# EAGLE design LED Controller Board (EAGLE 8.5.2)
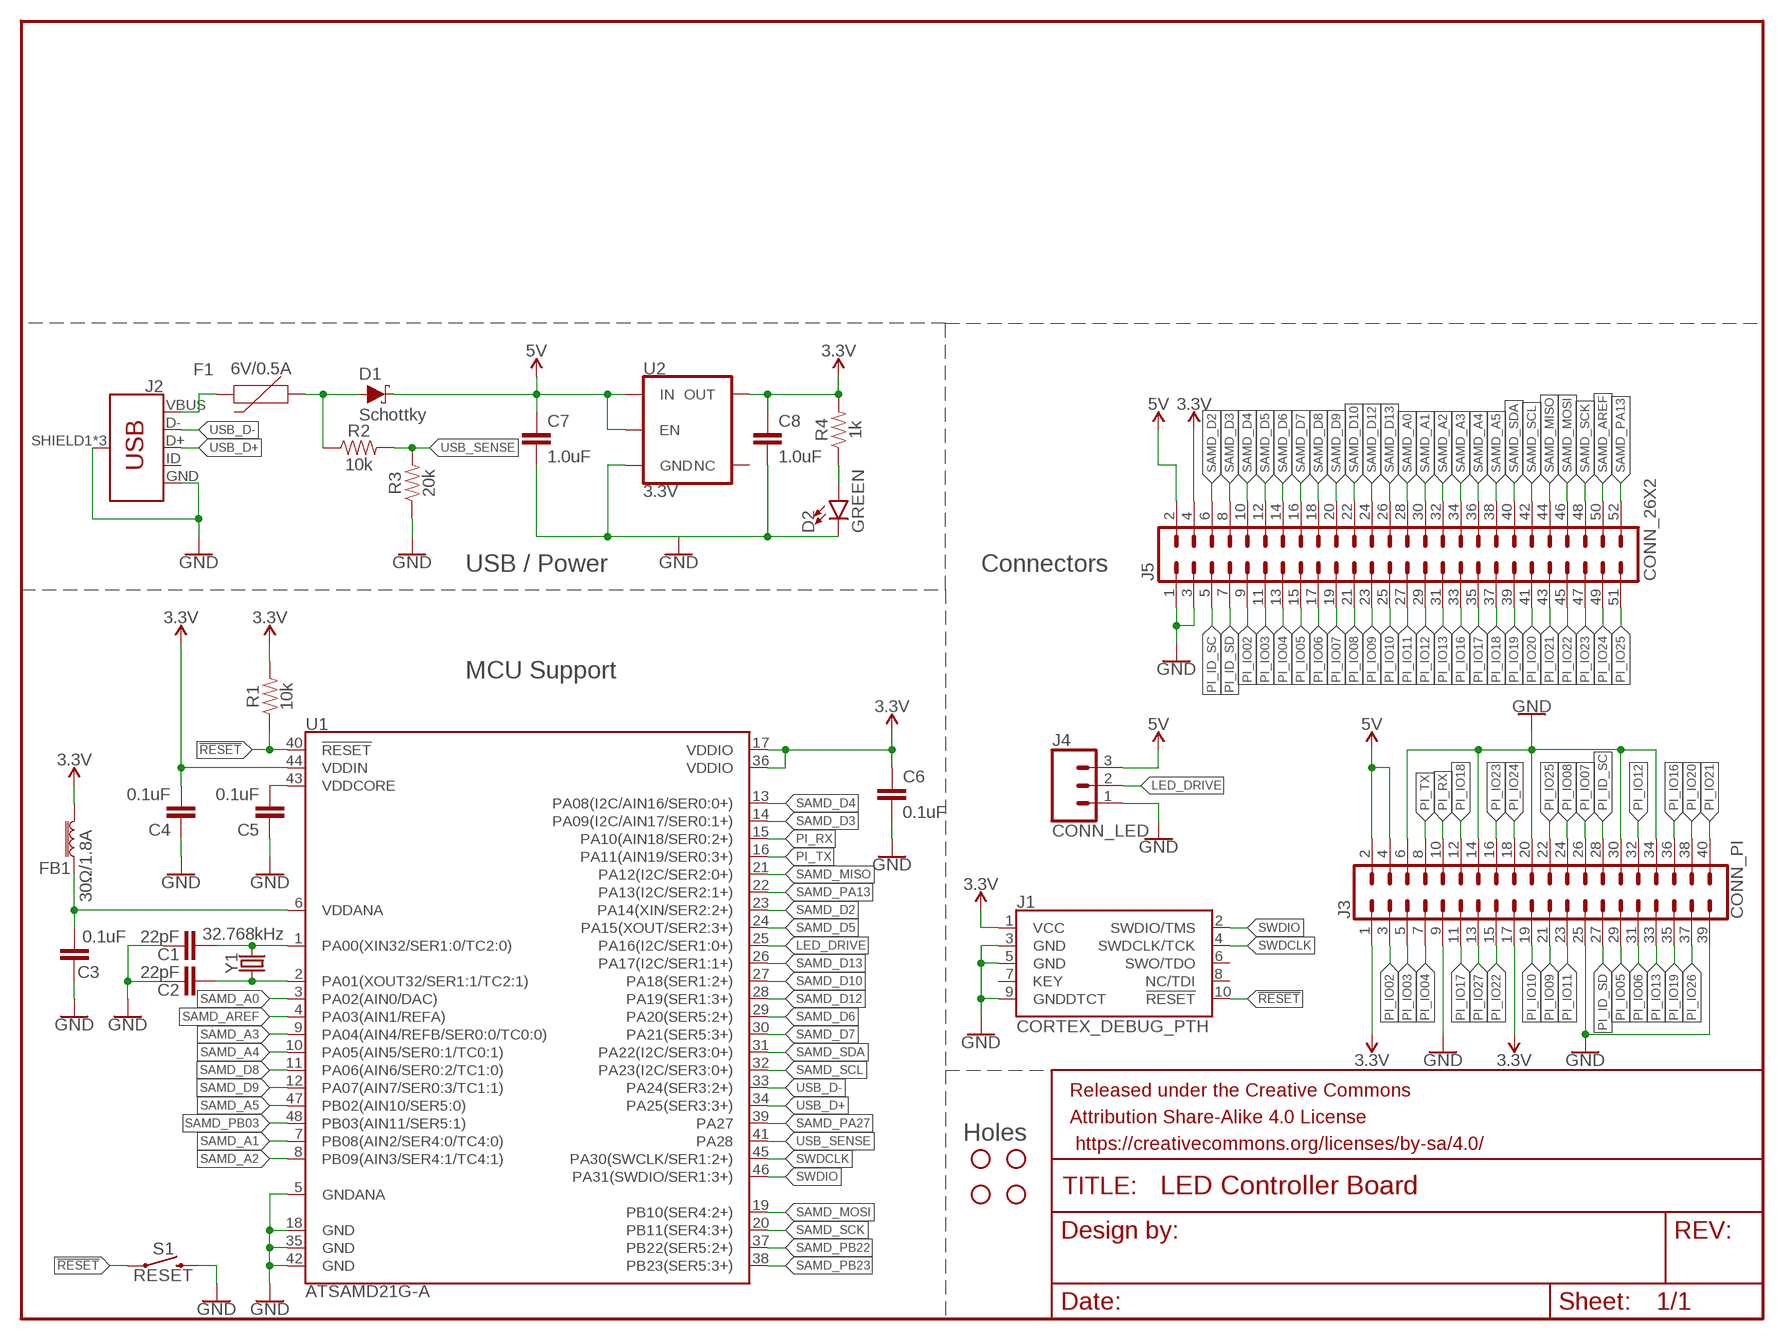
[diagram p0: schematic, sheet 1]

## Parts
C1  22pF  22PF-0603-50V-5%  [0603]
C2  22pF  22PF-0603-50V-5%  [0603]
C3  0.1uF  0.1UF-0603-25V-5%  [0603]
C4  0.1uF  0.1UF-0603-25V-5%  [0603]
C5  0.1uF  0.1UF-0603-25V-5%  [0603]
C6  0.1uF  0.1UF-0603-25V-5%  [0603]
C7  1.0uF  1.0UF-0603-16V-10%  [0603]
C8  1.0uF  1.0UF-0603-16V-10%  [0603]
D1  Schottky  DIODE-SCHOTTKY-BAT20J  [SOD-323]
D2  GREEN  LED-GREEN0603  [LED-0603]
F1  6V/0.5A  PPTC_HALF-AMP  [1206]
FB1  30Ω/1.8A  FERRITE_BEAD-0603  [0603]
FRAME1  FRAME-LETTERNO_PACKAGE  [DUMMY]
H1  STAND-OFFTIGHT  [STAND-OFF-TIGHT]
H2  STAND-OFFTIGHT  [STAND-OFF-TIGHT]
H3  STAND-OFFTIGHT  [STAND-OFF-TIGHT]
H4  STAND-OFFTIGHT  [STAND-OFF-TIGHT]
J1  CORTEX_DEBUG_PTH  [2X5-PTH-1.27MM]
J2  USB_MICRO-B_FEMALE-SMT  [USB-B-MICRO-SMD]
J3  CONN_PI  CONN_20X2  [2X20]
J4  CONN_LED  CONN_03LOCK  [1X03_LOCK]
J5  CONN_26X2  [2X26]
R1  10k  10KOHM-0603-1/10W-1%  [0603]
R2  10k  10KOHM-0603-1/10W-1%  [0603]
R3  20k  20KOHM-0603-1/10W-1%  [0603]
R4  1k  1KOHM-0603-1/10W-1%  [0603]
S1  RESET  MOMENTARY-SWITCH-SPST-PTH-RIGHT-ANGLE-KIT  [TACTILE_SWITCH_PTH_RIGHT_ANGLE_KIT]
U1  ATSAMD21G-A  [TQFP-48]
U2  3.3V  V_REG_AP2112K-3.3V  [SOT23-5]
Y1  32.768kHz  CRYSTAL-32.768KHZSMD-3.2X1.5  [CRYSTAL-SMD-3.2X1.5MM]

## Nets
3.3V: C4.2 C6.1 C8.1 FB1.2 J1.1(VCC) J3.1 J3.17 J5.4 R1.2 R4.2 U1.17(VDDIO) U1.36(VDDIO) U1.44(VDDIN) U2.5(OUT)
5V: C7.1 D1.C J3.2 J3.4 J4.3 J5.2 U2.1(IN) U2.3(EN)
!RESET: J1.10(!RESET) R1.1 S1.1 U1.40(!RESET!)
GND: C1.1 C2.1 C3.1 C4.1 C5.1 C6.2 C7.2 C8.2 D2.C J1.3(GND) J1.5(GND) J1.9(GNDDTCT) J2.GND J2.SHIELD1(SHIELD) J2.SHIELD2(SHIELD) J2.SHIELD3(SHIELD) J3.6 J3.9 J3.14 J3.20 J3.25 J3.30 J3.34 J3.39 J4.1 J5.1 J5.3 R3.1 S1.2 U1.5(GNDANA) U1.18(GND) U1.35(GND) U1.42(GND) U2.2(GND)
LED_DRIVE: J4.2 U1.25(PA16(I2C/SER1:0+))
N$1: C1.2 U1.1(PA00(XIN32/SER1:0/TC2:0)) Y1.P$2
N$2: C2.2 U1.2(PA01(XOUT32/SER1:1/TC2:1)) Y1.P$1
N$3: C3.2 FB1.1 U1.6(VDDANA)
N$4: C5.2 U1.43(VDDCORE)
N$25: F1.2 J2.VBUS
N$26: D1.A F1.1 R2.1
N$44: D2.A R4.1
PI_ID_SC: J3.28 J5.5
PI_ID_SD: J3.27 J5.7
PI_IO02: J3.3 J5.9
PI_IO03: J3.5 J5.11
PI_IO04: J3.7 J5.13
PI_IO05: J3.29 J5.15
PI_IO06: J3.31 J5.17
PI_IO07: J3.26 J5.19
PI_IO08: J3.24 J5.21
PI_IO09: J3.21 J5.23
PI_IO10: J3.19 J5.25
PI_IO11: J3.23 J5.27
PI_IO12: J3.32 J5.29
PI_IO13: J3.33 J5.31
PI_IO16: J3.36 J5.33
PI_IO17: J3.11 J5.35
PI_IO18: J3.12 J5.37
PI_IO19: J3.35 J5.39
PI_IO20: J3.38 J5.41
PI_IO21: J3.40 J5.43
PI_IO22: J3.15 J5.45
PI_IO23: J3.16 J5.47
PI_IO24: J3.18 J5.49
PI_IO25: J3.22 J5.51
PI_IO26: J3.37
PI_IO27: J3.13
PI_RX: J3.10 U1.15(PA10(AIN18/SER0:2+))
PI_TX: J3.8 U1.16(PA11(AIN19/SER0:3+))
SAMD_A0: J5.28 U1.3(PA02(AIN0/DAC))
SAMD_A1: J5.30 U1.7(PB08(AIN2/SER4:0/TC4:0))
SAMD_A2: J5.32 U1.8(PB09(AIN3/SER4:1/TC4:1))
SAMD_A3: J5.34 U1.9(PA04(AIN4/REFB/SER0:0/TC0:0))
SAMD_A4: J5.36 U1.10(PA05(AIN5/SER0:1/TC0:1))
SAMD_A5: J5.38 U1.47(PB02(AIN10/SER5:0))
SAMD_AREF: J5.50 U1.4(PA03(AIN1/REFA))
SAMD_D2: J5.6 U1.23(PA14(XIN/SER2:2+))
SAMD_D3: J5.8 U1.14(PA09(I2C/AIN17/SER0:1+))
SAMD_D4: J5.10 U1.13(PA08(I2C/AIN16/SER0:0+))
SAMD_D5: J5.12 U1.24(PA15(XOUT/SER2:3+))
SAMD_D6: J5.14 U1.29(PA20(SER5:2+))
SAMD_D7: J5.16 U1.30(PA21(SER5:3+))
SAMD_D8: J5.18 U1.11(PA06(AIN6/SER0:2/TC1:0))
SAMD_D9: J5.20 U1.12(PA07(AIN7/SER0:3/TC1:1))
SAMD_D10: J5.22 U1.27(PA18(SER1:2+))
SAMD_D12: J5.24 U1.28(PA19(SER1:3+))
SAMD_D13: J5.26 U1.26(PA17(I2C/SER1:1+))
SAMD_MISO: J5.44 U1.21(PA12(I2C/SER2:0+))
SAMD_MOSI: J5.46 U1.19(PB10(SER4:2+))
SAMD_PA13: J5.52 U1.22(PA13(I2C/SER2:1+))
SAMD_PA27: U1.39(PA27)
SAMD_PB03: U1.48(PB03(AIN11/SER5:1))
SAMD_PB22: U1.37(PB22(SER5:2+))
SAMD_PB23: U1.38(PB23(SER5:3+))
SAMD_SCK: J5.48 U1.20(PB11(SER4:3+))
SAMD_SCL: J5.42 U1.32(PA23(I2C/SER3:0+))
SAMD_SDA: J5.40 U1.31(PA22(I2C/SER3:0+))
SWDCLK: J1.4(SWDCLK/TCK) U1.45(PA30(SWCLK/SER1:2+))
SWDIO: J1.2(SWDIO/TMS) U1.46(PA31(SWDIO/SER1:3+))
USB_D+: J2.D+ U1.34(PA25(SER3:3+))
USB_D-: J2.D- U1.33(PA24(SER3:2+))
USB_SENSE: R2.2 R3.2 U1.41(PA28)
Unconnected: J1.6(SWO/TDO) J1.7(KEY) J1.8(NC/TDI) J2.ID U2.4(NC)

## Notes on the sheet
- USB / Power | Connectors
- MCU Support
- Holes

## Library data of the parts
C1 C2 = SparkFun-Capacitors:22PF: 22pF ceramic capacitors A capacitor is a passive two-terminal electrical component used to store electrical energy temporarily in an electric field.; PROD_ID: CAP-07876
C3-C6 = SparkFun-Capacitors:0.1UF: 0.1µF ceramic capacitors A capacitor is a passive two-terminal electrical component used to store electrical energy temporarily in an electric field.; PROD_ID: CAP-08604
C7 C8 = SparkFun-Capacitors:1.0UF: 1µF ceramic capacitors A capacitor is a passive two-terminal electrical component used to store electrical energy temporarily in an electric field.; PROD_ID: CAP-00868
D1 = SparkFun-DiscreteSemi:DIODE-SCHOTTKY: Schottky diode A Schottky diode is a semiconductor diode which has a low forward voltage drop and a very fast switching action.; PROD_ID: DIO-11623; VALUE: 1A/23V/620mV
D2 = SparkFun-LED:LED-GREEN: Green SMD LED Used in manufacturing of various products at SparkFun Packages: 0603 - SMD 0603 package [Product Link] <http://www.futureelectronics.com/en/technologies/semiconductors/optoelectronics/leds/Pages/9894312-LTST-C190GKT.aspx?CrossPart=HSMG-C190&IM=0> LilyPad 1206 - SMD1206 LilyPad package [Product Link] <http://www.futureelectronics.com/en/Technologies/Product.aspx?ProductID=IN150NGHARVATEKCORPORATION2049943&IM=0> 1206 - SMD1206 package [Product Link] <http://www.futureelectronics.com/en/technologies/semiconductors/optoelectronics/leds/Pages/8315665-LTST-C150KGKT.aspx?IM=0> 1206 Bottom Mount -SMD 1206 Bottom Mount [Product Link] <http://www.digikey.com/product-detail/en/lite-on-inc/LTST-C230KGKT/160-1456-1-ND/386854> SparkFun Products: Pro Mini 328 -5V <https://www.sparkfun.com/products/821> RedBoard <https://www.sparkfun.com/products/12757> MP3 Trigger <https://www.sparkfun.com/products/13720> Makey Makey <https://www.sparkfun.com/products/11076>; PROD_ID: DIO-00821
F1 = SparkFun-Fuses:PPTC: Resettable Fuse PPTC Resettable Fuse. Really a sort of resistor with a polymeric positive temperature coefficient whose resistance increases dramatically with an increase in temperature. When heated by the power passing through the resistance rises causing the current to be limited, protecting the circuit. This is achieved by the transition of the polymer from a crystalline to an amorphous state where the conductive carbon separates breaking the conductive pathways found in the cool crystalline structure. When a PPTC cools back down it resumes conducting letting the circuit turn back on. SparkFun Products: SparkFun RedBoard - Programmed with Arduino <https://www.sparkfun.com/products/12757> Pro Micro - 5V/16MHz <https://www.sparkfun.com/products/12640> Arduino Pro 328 - 5V/16MHz <https://www.sparkfun.com/products/10915> MP3 Trigger <https://www.sparkfun.com/products/13720>; PROD_ID: RES-08585
FB1 = SparkFun-Coils:FERRITE_BEAD: Ferrite Bead (blocks, cores, rings, chokes, etc.) Inductor with layers of ferrite used to suppress high frequencies. Often used to isolate high frequency noise. SparkFun Products: IOIO-OTG - V2.2 <https://www.sparkfun.com/products/13613> SparkFun SAMD21 Mini Breakout <https://www.sparkfun.com/products/13664> SparkFun 6 Degrees of Freedom Breakout - LSM6DS3 <https://www.sparkfun.com/products/13339> SparkFun SAMD21 Dev Breakout <https://www.sparkfun.com/products/13672>; PROD_ID: NDUC-07859
FRAME1 = SparkFun-Aesthetics:FRAME-LETTER: Schematic Frame - Letter Standard 8.5x11 US Letter frame; DESIGNER: Nobody; VERSION: v01
H1-H4 = SparkFun-Hardware:STAND-OFF: Stand Off Drill holes for mechanically mounting via screws, standoffs, etc. Note: Use the keepout ring to avoid running the screw head into surrounding components. Variant Overviews STAND-OFF - Mechanical footprint for a #4 phillips button head screw. STAND-OFF-TIGHT - Mechanical footprint for a #4 phillips button head screw, Example SparkFun Products Screw - Phillips Head (1/4", 4-40, 10 pack) <https://www.sparkfun.com/products/10453> (PRT-10453) Screw - Phillips Head (1/2", 4-40, 10 pack) <https://www.sparkfun.com/products/10452> (PRT-10452) Screw - Phillips Head (3/4", 4-40, 10 pack) <https://www.sparkfun.com/products/10451> (PRT-10451) Screw - Phillips Head (1", 4-40, 10 pack) <https://www.sparkfun.com/products/10450> (PRT-10450)
J1 = SparkFun-Connectors:CORTEX_DEBUG: Cortex Debug Connector - 10 pin Supports JTAG debug, Serial Wire debug, and Serial Wire Viewer. PTH and SMD connector options available. General Connector Information <http://infocenter.arm.com/help/topic/com.arm.doc.faqs/attached/13634/cortex_debug_connectors.pdf> Products: PTH Connector <http://www.digikey.com/product-detail/en/cnc-tech/3220-10-0100-00/1175-1627-ND/3883661> -via Digi-Key SparkFun PSoc <https://www.sparkfun.com/products/13229> SparkFun T <https://www.sparkfun.com/products/13810>
J2 = SparkFun-Connectors:USB_MICRO-B: USB Type Micro-B Connector Male/female and PTH/SMT variants SparkFun Products: SparkFun microB USB Breakout <https://www.sparkfun.com/products/12035> SparkFun USB microB Plug Breakout <https://www.sparkfun.com/products/10031> SparkFun ESP8266 Thing <https://www.sparkfun.com/products/13231>; PROD_ID: CONN-11752
J3 = SparkFun-Connectors:CONN_20X2: Multi connection point. Often used as Generic Header-pin footprint for 0.1 inch spaced/style header connections On any of the 0.1 inch spaced packages, you can populate with these: Break Away Headers - Straight <https://www.sparkfun.com/products/116> (PRT-00116) Break Away Male Headers - Right Angle <https://www.sparkfun.com/products/553> (PRT-00553) Female Headers <https://www.sparkfun.com/products/115> (PRT-00115) Break Away Headers - Machine Pin <https://www.sparkfun.com/products/117> (PRT-00117) Break Away Female Headers - Swiss Machine Pin <https://www.sparkfun.com/products/743> (PRT-00743)
J4 = SparkFun-Connectors:CONN_03: Multi connection point. Often used as Generic Header-pin footprint for 0.1 inch spaced/style header connections On any of the 0.1 inch spaced packages, you can populate with these: Break Away Headers - Straight <https://www.sparkfun.com/products/116> (PRT-00116) Break Away Male Headers - Right Angle <https://www.sparkfun.com/products/553> (PRT-00553) Female Headers <https://www.sparkfun.com/products/115> (PRT-00115) Break Away Headers - Machine Pin <https://www.sparkfun.com/products/117> (PRT-00117) Break Away Female Headers - Swiss Machine Pin <https://www.sparkfun.com/products/743> (PRT-00743) Stackable Header - 3 Pin (Female, 0.1") <https://www.sparkfun.com/products/13875> (PRT-13875) For SCREWTERMINALS and SPRING TERMINALS visit here: Screw Terimnals on SparkFun.com <https://www.sparkfun.com/search/results?term=Screw+Terminals> (5mm/3.5mm/2.54mm spacing) This device is also useful as a general connection point to wire up your design to another part of your project. Our various solder wires solder well into these plated through hole pads. Hook-Up Wire - Assortment (Stranded, 22 AWG) <https://www.sparkfun.com/products/11375> (PRT-11375) Hook-Up Wire - Assortment (Solid Core, 22 AWG) <https://www.sparkfun.com/products/11367> (PRT-11367) View the entire wire category on our website here <https://www.sparkfun.com/categories/141> Special notes: Molex polarized connector foot print use with SKU : PRT-08232 with associated crimp pins and housings.
J5 = SparkFun-Connectors:CONN_26X2: Multi connection point. Often used as Generic Header-pin footprint for 0.1 inch spaced/style header connections On any of the 0.1 inch spaced packages, you can populate with these: Break Away Headers - Straight <https://www.sparkfun.com/products/116> (PRT-00116) Break Away Male Headers - Right Angle <https://www.sparkfun.com/products/553> (PRT-00553) Female Headers <https://www.sparkfun.com/products/115> (PRT-00115) Break Away Headers - Machine Pin <https://www.sparkfun.com/products/117> (PRT-00117) Break Away Female Headers - Swiss Machine Pin <https://www.sparkfun.com/products/743> (PRT-00743)
R1 R2 = SparkFun-Resistors:10KOHM: 10kΩ resistor A resistor is a passive two-terminal electrical component that implements electrical resistance as a circuit element. Resistors act to reduce current flow, and, at the same time, act to lower voltage levels within circuits. - Wikipedia; PROD_ID: RES-00824
R3 = SparkFun-Resistors:20KOHM: 20kΩ resistor A resistor is a passive two-terminal electrical component that implements electrical resistance as a circuit element. Resistors act to reduce current flow, and, at the same time, act to lower voltage levels within circuits. - Wikipedia; PROD_ID: RES-09383
R4 = SparkFun-Resistors:1KOHM: 1kΩ resistor A resistor is a passive two-terminal electrical component that implements electrical resistance as a circuit element. Resistors act to reduce current flow, and, at the same time, act to lower voltage levels within circuits. - Wikipedia; PROD_ID: RES-07856
S1 = SparkFun-Switches:MOMENTARY-SWITCH-SPST: Momentary Switch (Pushbutton) - SPST Normally-open (NO) SPST momentary switches (buttons, pushbuttons). Variants PTH-12MM - 12mm square, through-hole Momentary Pushbutton Switch - 12mm Square <https://www.sparkfun.com/products/9190> (COM-09190) PTH-6.0MM, PTH-6.0MM-KIT - 6.0mm square, through-hole Mini Pushbutton Switch <https://www.sparkfun.com/products/97> (COM-00097) KIT package intended for soldering kit's - only one side of pads' copper is exposed. PTH-RIGHT-ANGLE-KIT - Right-angle, through-hole Right Angle Tactile Button <https://www.sparkfun.com/products/10791> - Used on SparkFun BigTime Watch Kit <https://www.sparkfun.com/products/11734> SMD-12MM - 12mm square, surface-mount Tactile Button - SMD (12mm) <https://www.sparkfun.com/products/12993> (COM-12993) Used on SparkFun PicoBoard <https://www.sparkfun.com/products/11888> SMD-4.5MM - 4.5mm Square Trackball Switch Used on SparkFun Blackberry Trackballer Breakout <https://www.sparkfun.com/products/13169> SMD-4.6MMX2.8MM - 4.60mm x 2.80mm, surface mount Used on SparkFun SAMD21 Mini Breakout <https://www.sparkfun.com/products/13664> SMD-5.2MM, SMD-5.2-REDUNDANT - 5.2mm square, surface-mount Mini Pushbutton Switch - SMD <https://www.sparkfun.com/products/8720> (COM-08720) Used on Arduino Pro Mini <https://www.sparkfun.com/products/11114> REDUNDANT package connects both switch circuits together SMD-6.0X3.5MM - 6.0 x 3.5mm, surface mount Momentary Reset Switch SMD <https://www.sparkfun.com/products/8229> (COM-08229) SMD-6.2MM-TALL - 6.2mm square, surface mount Tactile Button - SMD (6mm) <https://www.sparkfun.com/products/12992> Used on SparkFun Digital Sandbox <https://www.sparkfun.com/products/12651> SMD-RIGHT-ANGLE - Right-angle, surface mount Used on SparkFun Block for Intel® Edison - Arduino <https://www.sparkfun.com/products/13036>; PROD_ID: CONN-10672; SF_SKU: COM-10791
U1 = SparkFun-IC-Microcontroller:ATSAMD21G: Atmel SAMD21G SMART ARM-Based Microcontroller The Atmel ® | SMART ™ SAM D21 is a series of low-power microcontrollers using the 32-bit ARM ® Cortex ® -M0+ processor, and ranging from 32- to 64-pins with up to 256KB Flash and 32KB of SRAM. The SAM D21 devices operate at a maximum frequency of 48MHz and reach 2.46 CoreMark/MHz. They are designed for simple and intuitive migration with identical peripheral modules, hex compatible code, identical linear address map and pin compatible migration paths between all devices in the product series. All devices include intelligent and flexible peripherals, Atmel Event System for inter-peripheral signaling, and support for capacitive touch button, slider and wheel user interfaces. Datasheet <https://cdn.sparkfun.com/datasheets/Dev/Arduino/Boards/Atmel-42181-SAM-D21_Datasheet.pdf> SparkFun Products SparkFun SAMD21 Mini Breakout <https://www.sparkfun.com/products/13664> (DEV-13664) SparkFun SAMD21 Dev Breakout <https://www.sparkfun.com/products/13672> (DEV-13672); PROD_ID: IC-13064
U2 = SparkFun-IC-Power:V_REG_AP2112: AP2112 - 600mA CMOS LDO Regulator w/ Enable The AP2112 is CMOS process low dropout linear regulator with enable function, the regulator delivers a guaranteed 600mA (min.) continuous load current. Features Output Voltage Accuracy: ±1.5% Output Current: 600mA (Min.) Foldback Short Current Protection: 50mA Enable Function to Turn ON/OFF VOUT Low Dropout Voltage (3.3V): 250mV (Typ.) @IOUT=600mA Excellent Load Regulation: 0.2%/A (Typ.) Excellent Line Regulation: 0.02%/V (Typ.) Low Quiescent Current: 55μA (Typ.) Low Standby Current: 0.01μA (Typ.) Low Output Noise: 50μVRMS PSRR: 100Hz -65dB, 1kHz -65dB OTSD Protection Stable with 1.0μF Flexible Cap: Ceramic, Tantalum and Aluminum Electrolytic Operation Temperature Range: -40°C to 85°C ESD: MM 400V, HBM 4000V; PROD_ID: VREG-12457
Y1 = SparkFun-Clocks:CRYSTAL-32.768KHZ: 32.768kHz Crystal Frequency: 32.768kHz Frequency Stability: ±20ppm Load Capacitance: 12.5pF (PTH-2X6 & SMD-3.2X1.5), 6pF (SMD-2X6) SparkFun Products: SparkFun BigTime Watch Kit <https://www.sparkfun.com/products/11734> SparkFun nRF52832 Breakout <https://www.sparkfun.com/products/13990> SparkFun Real Time Clock Module <https://www.sparkfun.com/products/12708>; PROD_ID: XTAL-13062

## Board
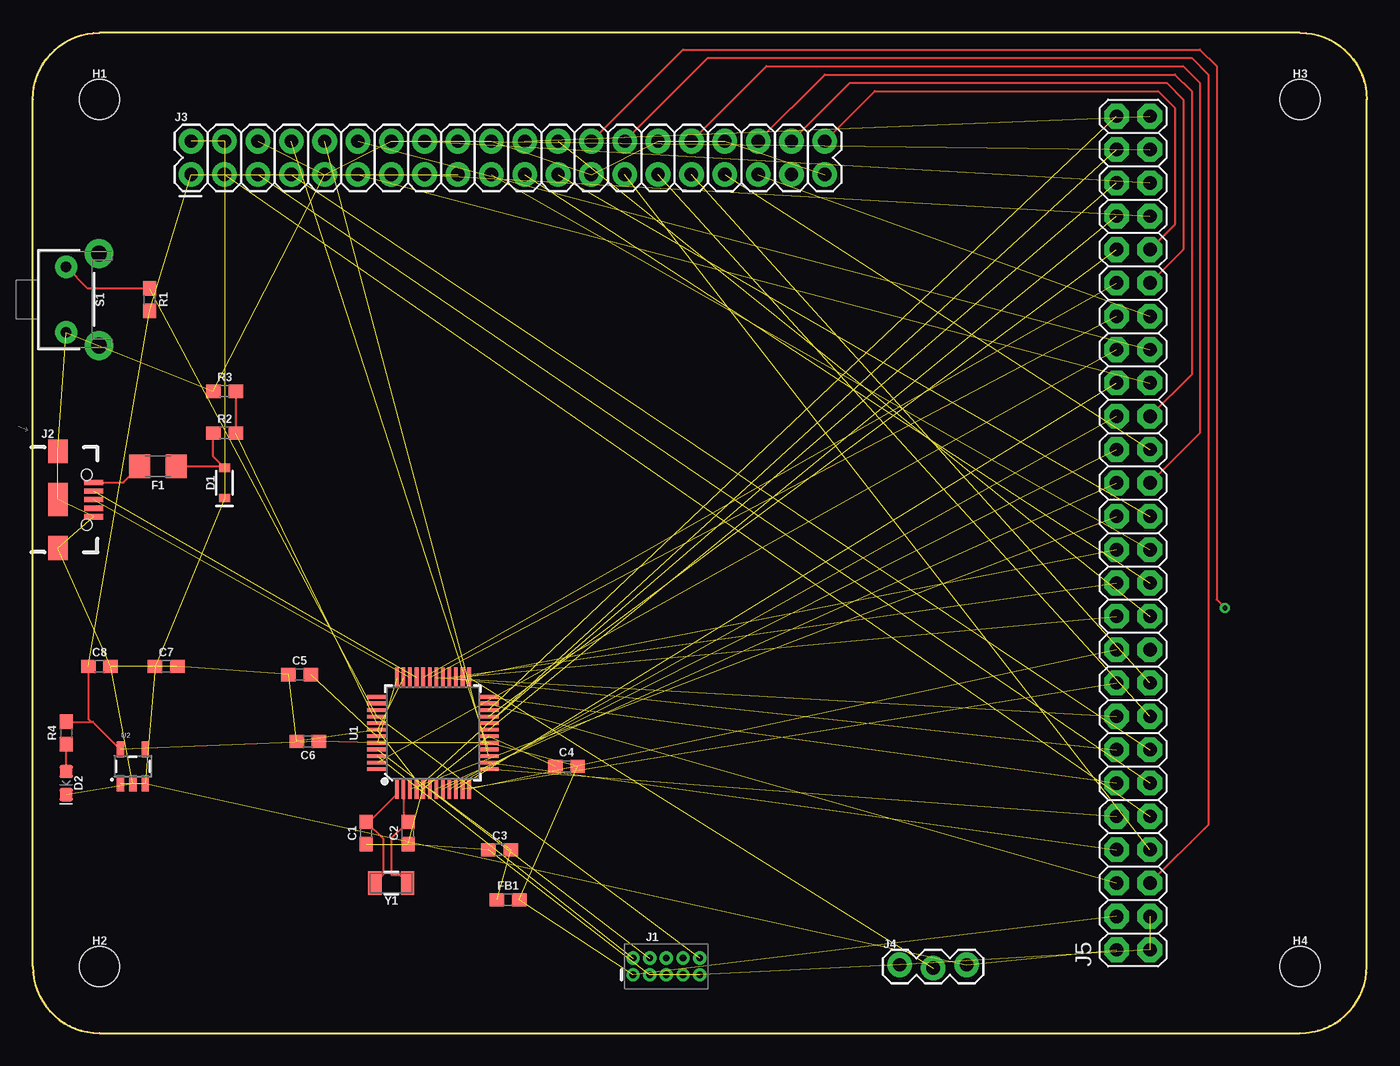
[diagram p1: board, top side]
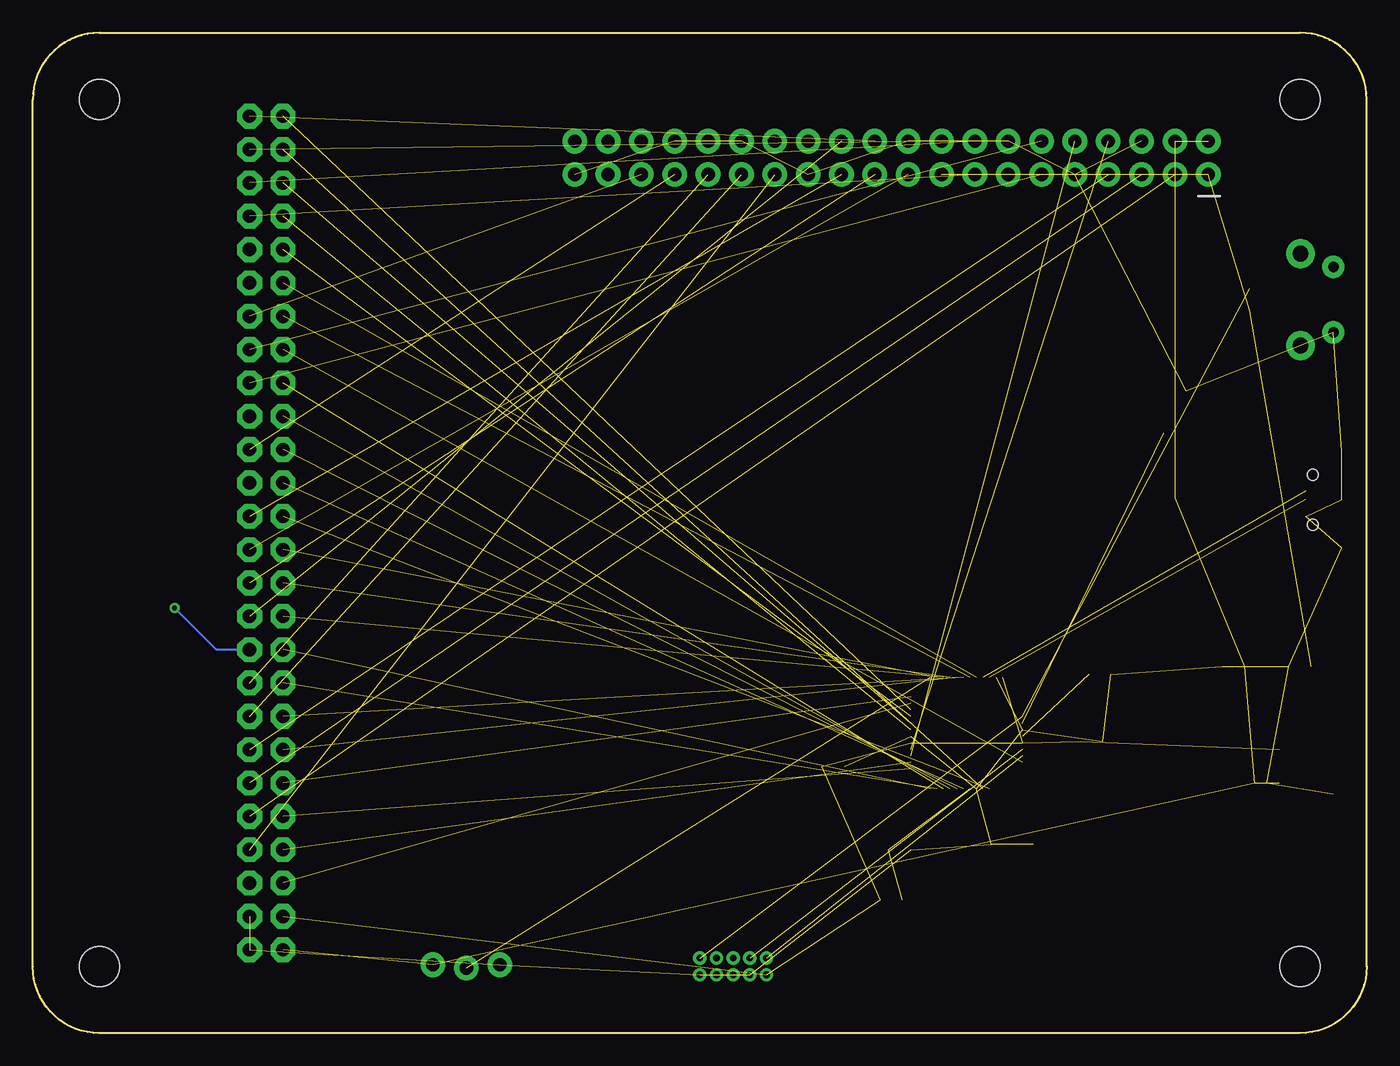
[diagram p2: board, bottom side, seen from below]

Size 101.6 x 76.2 mm. Coordinates in mm from the lower left corner, seen from the top.
Outline: 0,5.08 0,71.12 arc-90 5.08,76.2 96.52,76.2 arc-90 101.6,71.12 101.6,5.08 arc-90 96.52,0 5.08,0 arc-90 0,5.08
Copper layers (1*16): Top 0.035mm / dielectric 1.5mm / Bottom 0.035mm
Design rules "default": minimum track width 6mil, minimum drill 0.35mm, track to track 6mil, track to pad 6mil, pad to pad 6mil, via to via 6mil, smd to smd 6mil, copper to edge 40mil, drill to drill 6mil, minimum pad ring 10mil, minimum via ring 8mil, stop-mask expansion 4mil, vias tented up to drill 0mil, thermal gap 10mil

### Footprints (pad centres in the part's own frame; a part is rotated, then mirrored left to right if it is on the bottom)
0603 = smd 1.1 x 1: 1 -0.85,0; 2 0.85,0
SOD-323 = smd 0.63 x 0.83: A 1.15,0; C -1.15,0
LED-0603 = smd 1 x 1: A -0.877,0; C 0.877,0
1206 = smd 1.6 x 1.8: 1 -1.4,0; 2 1.4,0
STAND-OFF-TIGHT = hole 3.048: 0,0
2X5-PTH-1.27MM = drill 0.508 pad 1: 1 -2.54,-0.635; 2 -2.54,0.635; 3 -1.27,-0.635; 4 -1.27,0.635; 5 0,-0.635; 6 0,0.635; 7 1.27,-0.635; 8 1.27,0.635; 9 2.54,-0.635; 10 2.54,0.635
USB-B-MICRO-SMD = smd 1.45 x 0.4: D+ 2.725,0; D- 2.725,0.65; GND 2.725,-1.3; ID 2.725,-0.65; VBUS 2.725,1.3 | smd 1.5 x 1.8: SHIELD1 0,3.685; SHIELD2 0,-3.685 | smd 1.5 x 2.5: SHIELD3 0,0 | hole 0.85: 2.2,1.9; 2.2,-1.9
2X20 = drill 1.016 pad 1.88: 1 0,0; 2 0,2.54; 3 2.54,0; 4 2.54,2.54; 5 5.08,0; 6 5.08,2.54; 7 7.62,0; 8 7.62,2.54; 9 10.16,0; 10 10.16,2.54; 11 12.7,0; 12 12.7,2.54; 13 15.24,0; 14 15.24,2.54; 15 17.78,0; 16 17.78,2.54; 17 20.32,0; 18 20.32,2.54; 19 22.86,0; 20 22.86,2.54; 21 25.4,0; 22 25.4,2.54; 23 27.94,0; 24 27.94,2.54; 25 30.48,0; 26 30.48,2.54; 27 33.02,0; 28 33.02,2.54; 29 35.56,0; 30 35.56,2.54; 31 38.1,0; 32 38.1,2.54; 33 40.64,0; 34 40.64,2.54; 35 43.18,0; 36 43.18,2.54; 37 45.72,0; 38 45.72,2.54; 39 48.26,0; 40 48.26,2.54
1X03_LOCK = drill 1.016 pad 1.88: 1 0,0.127; 2 2.54,-0.127; 3 5.08,0.127
2X26 = drill 1.016 pad 1.88 octagon: 1 -11.43,-1.27; 2 -11.43,1.27; 3 -8.89,-1.27; 4 -8.89,1.27; 5 -6.35,-1.27; 6 -6.35,1.27; 7 -3.81,-1.27; 8 -3.81,1.27; 9 -1.27,-1.27; 10 -1.27,1.27; 11 1.27,-1.27; 12 1.27,1.27; 13 3.81,-1.27; 14 3.81,1.27; 15 6.35,-1.27; 16 6.35,1.27; 17 8.89,-1.27; 18 8.89,1.27; 19 11.43,-1.27; 20 11.43,1.27; 21 13.97,-1.27; 22 13.97,1.27; 23 16.51,-1.27; 24 16.51,1.27; 25 19.05,-1.27; 26 19.05,1.27; 27 21.59,-1.27; 28 21.59,1.27; 29 24.13,-1.27; 30 24.13,1.27; 31 26.67,-1.27; 32 26.67,1.27; 33 29.21,-1.27; 34 29.21,1.27; 35 31.75,-1.27; 36 31.75,1.27; 37 34.29,-1.27; 38 34.29,1.27; 39 36.83,-1.27; 40 36.83,1.27; 41 39.37,-1.27; 42 39.37,1.27; 43 41.91,-1.27; 44 41.91,1.27; 45 44.45,-1.27; 46 44.45,1.27; 47 46.99,-1.27; 48 46.99,1.27; 49 49.53,-1.27; 50 49.53,1.27; 51 52.07,-1.27; 52 52.07,1.27
TACTILE_SWITCH_PTH_RIGHT_ANGLE_KIT = drill 0.8 pad 1.7: 1 -2.5,0; 2 2.5,0 | drill 1.2 pad 2.2: ANCHOR1 -3.5,2.5; ANCHOR2 3.5,2.5
TQFP-48 = smd 1.5 x 0.28: 1 -4.25,2.75; 2 -4.25,2.25; 3 -4.25,1.75; 4 -4.25,1.25; 5 -4.25,0.75; 6 -4.25,0.25; 7 -4.25,-0.25; 8 -4.25,-0.75; 9 -4.25,-1.25; 10 -4.25,-1.75; 11 -4.25,-2.25; 12 -4.25,-2.75; 25 4.25,-2.75; 26 4.25,-2.25; 27 4.25,-1.75; 28 4.25,-1.25; 29 4.25,-0.75; 30 4.25,-0.25; 31 4.25,0.25; 32 4.25,0.75; 33 4.25,1.25; 34 4.25,1.75; 35 4.25,2.25; 36 4.25,2.75 | smd 0.28 x 1.5: 13 -2.75,-4.25; 14 -2.25,-4.25; 15 -1.75,-4.25; 16 -1.25,-4.25; 17 -0.75,-4.25; 18 -0.25,-4.25; 19 0.25,-4.25; 20 0.75,-4.25; 21 1.25,-4.25; 22 1.75,-4.25; 23 2.25,-4.25; 24 2.75,-4.25; 37 2.75,4.25; 38 2.25,4.25; 39 1.75,4.25; 40 1.25,4.25; 41 0.75,4.25; 42 0.25,4.25; 43 -0.25,4.25; 44 -0.75,4.25; 45 -1.25,4.25; 46 -1.75,4.25; 47 -2.25,4.25; 48 -2.75,4.25
SOT23-5 = smd 0.55 x 1.2: 1 -0.95,-1.3; 2 0,-1.3; 3 0.95,-1.3; 4 0.95,1.3; 5 -0.95,1.3
CRYSTAL-SMD-3.2X1.5MM = smd 1 x 1.8: P$1 -1.25,0; P$2 1.25,0

### Placement (x,y rotation side)
C1  25.4,15.24 90 top
C2  28.57,15.24 90 top
C3  35.56,13.97 0 top
C4  40.64,20.32 0 top
C5  20.32,27.3 0 top
C6  20.95,22.23 180 top
C7  10.16,27.94 0 top
C8  5.08,27.94 0 top
D1  14.61,41.91 90 top
D2  2.54,19.05 270 top
F1  9.53,43.18 180 top
FB1  36.2,10.16 0 top
FRAME1  -12.7,-12.7 0 top  (outside the outline)
H1  5.08,71.12 0 top
H2  5.08,5.08 0 top
H3  96.52,71.12 0 top
H4  96.52,5.08 0 top
J1  48.26,5.08 0 top
J2  1.91,40.64 0 top
J3  12.06,65.41 0 top
J4  66.04,5.08 0 top
J5  83.82,17.78 90 top
R1  8.89,55.88 270 top
R2  14.61,45.72 0 top
R3  14.61,48.9 0 top
R4  2.54,22.86 90 top
S1  2.54,55.88 270 top
U1  30.48,22.86 90 top
U2  7.62,20.32 0 top
Y1  27.3,11.43 180 top

### Tracks (layer width: path | path; a pad name or v marks a point on that pad's centre or on a via)
3.3V  (11 unrouted)
  Top 0.152: R4.2 4.45,23.71 | 4.45,23.71 4.58,23.71 U2.5 | C8.1 4.23,23.93 4.45,23.71
5V  (7 unrouted)
!RESET  (2 unrouted)
  Top 0.152: R1.1 4.19,56.73 S1.1
GND  (33 unrouted)
LED_DRIVE  (1 unrouted)
N$1
  Top 0.152: C1.2 25.51,15.98 | 25.51,15.98 26.67,14.82 26.67,12.04 Y1.P$2 | U1.1 27.73,18.2 25.51,15.98
N$2
  Top 0.152: C2.2 28.47,15.98 | 28.47,15.98 27.3,14.82 27.3,12.06 27.92,12.06 Y1.P$1 | U1.2 28.23,16.22 28.47,15.98
N$3  (2 unrouted)
N$4  (1 unrouted)
N$25
  Top 0.152: J2.VBUS 6.88,41.94 F1.2
N$26
  Top 0.152: R2.1 13.76,43.91 D1.A 14.48,43.18 F1.1
N$44
  Top 0.152: D2.A R4.1
PI_ID_SC
  Top 0.152: J3.28 51.44,74.3 88.27,74.3 89.53,73.03 89.53,15.88 J5.5
PI_ID_SD  (1 unrouted)
PI_IO02  (1 unrouted)
PI_IO03  (1 unrouted)
PI_IO04  (1 unrouted)
PI_IO05  (1 unrouted)
PI_IO06  (1 unrouted)
PI_IO07  (via drill 0.35)
  Top 0.152: J3.26 49.53,74.93 88.9,74.93 90.17,73.66 90.17,33.02 v90.81,32.38
  Bottom 0.152: v90.81,32.38 87.63,29.21 J5.19
PI_IO08  (1 unrouted)
PI_IO09  (1 unrouted)
PI_IO10  (1 unrouted)
PI_IO11  (1 unrouted)
PI_IO12
  Top 0.152: J3.32 55.88,73.66 87.63,73.66 88.9,72.39 88.9,45.72 J5.29
PI_IO13  (1 unrouted)
PI_IO16
  Top 0.152: J3.36 60.33,73.03 87,73.03 88.27,71.75 88.27,50.16 J5.33
PI_IO17  (1 unrouted)
PI_IO18  (1 unrouted)
PI_IO19  (1 unrouted)
PI_IO20
  Top 0.152: J3.38 62.23,72.39 86.36,72.39 87.63,71.12 87.63,59.69 J5.41
PI_IO21
  Top 0.152: J3.40 64.14,71.75 85.72,71.75 87,70.48 87,61.59 J5.43
PI_IO22  (1 unrouted)
PI_IO23  (1 unrouted)
PI_IO24  (1 unrouted)
PI_IO25  (1 unrouted)
PI_RX  (1 unrouted)
PI_TX  (1 unrouted)
SAMD_A0  (1 unrouted)
SAMD_A1  (1 unrouted)
SAMD_A2  (1 unrouted)
SAMD_A3  (1 unrouted)
SAMD_A4  (1 unrouted)
SAMD_A5  (1 unrouted)
SAMD_AREF  (1 unrouted)
SAMD_D2  (1 unrouted)
SAMD_D3  (1 unrouted)
SAMD_D4  (1 unrouted)
SAMD_D5  (1 unrouted)
SAMD_D6  (1 unrouted)
SAMD_D7  (1 unrouted)
SAMD_D8  (1 unrouted)
SAMD_D9  (1 unrouted)
SAMD_D10  (1 unrouted)
SAMD_D12  (1 unrouted)
SAMD_D13  (1 unrouted)
SAMD_MISO  (1 unrouted)
SAMD_MOSI  (1 unrouted)
SAMD_PA13  (1 unrouted)
SAMD_SCK  (1 unrouted)
SAMD_SCL  (1 unrouted)
SAMD_SDA  (1 unrouted)
SWDCLK  (1 unrouted)
SWDIO  (1 unrouted)
USB_D+  (1 unrouted)
USB_D-  (1 unrouted)
USB_SENSE  (1 unrouted)
  Top 0.152: R3.2 R2.2